# EAGLE design Head Lamp (EAGLE 8.2.2)
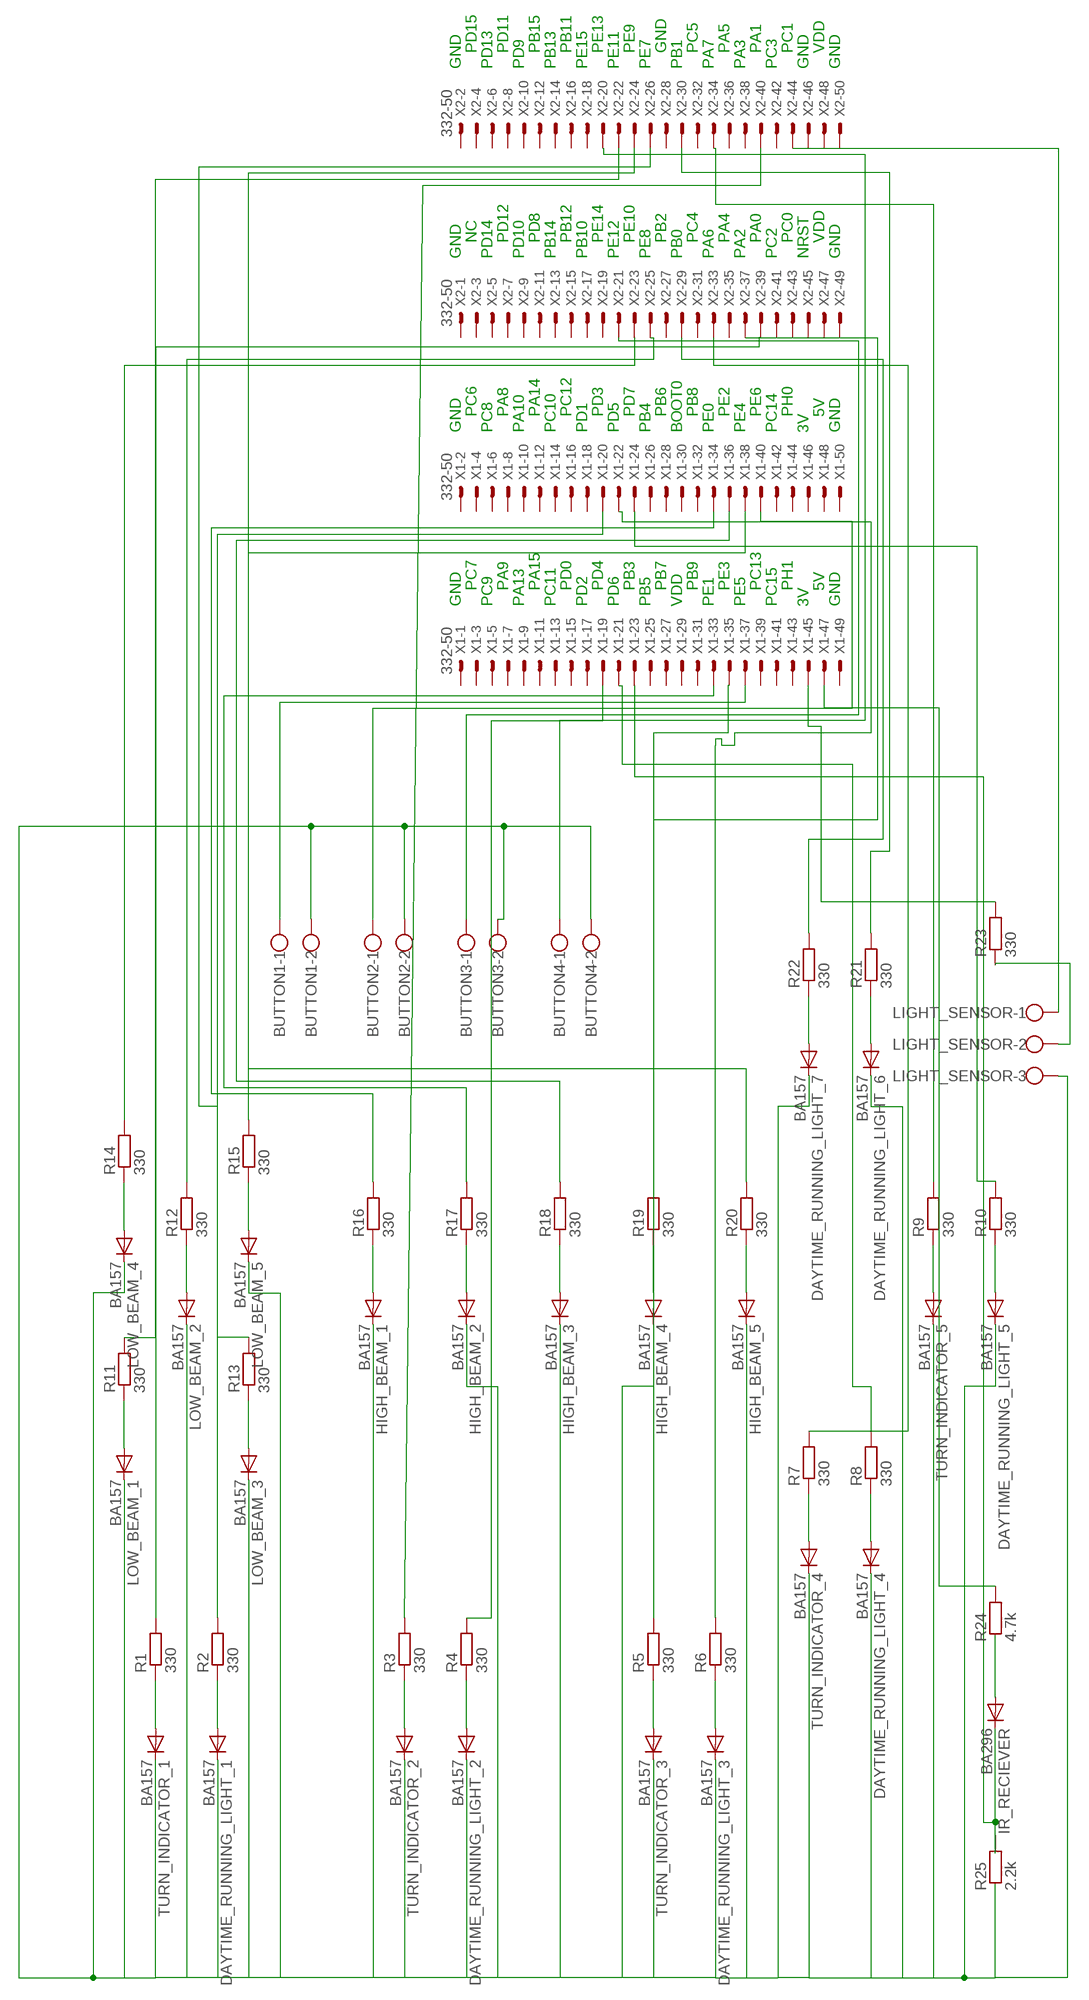
[diagram p0: schematic, sheet 1]

## Parts
BUTTON1  W237-102  [W237-102]
BUTTON2  W237-102  [W237-102]
BUTTON3  W237-102  [W237-102]
BUTTON4  W237-102  [W237-102]
DAYTIME_RUNNING_LIGHT_1  BA157  [P1-10]
DAYTIME_RUNNING_LIGHT_2  BA157  [P1-10]
DAYTIME_RUNNING_LIGHT_3  BA157  [P1-10]
DAYTIME_RUNNING_LIGHT_4  BA157  [P1-10]
DAYTIME_RUNNING_LIGHT_5  BA157  [P1-10]
DAYTIME_RUNNING_LIGHT_6  BA157  [P1-10]
DAYTIME_RUNNING_LIGHT_7  BA157  [P1-10]
HIGH_BEAM_1  BA157  [P1-10]
HIGH_BEAM_2  BA157  [P1-10]
HIGH_BEAM_3  BA157  [P1-10]
HIGH_BEAM_4  BA157  [P1-10]
HIGH_BEAM_5  BA157  [P1-10]
IR_RECIEVER  BA296  [P2-15]
LIGHT_SENSOR  W237-103  [W237-103]
LOW_BEAM_1  BA157  [P1-10]
LOW_BEAM_2  BA157  [P1-10]
LOW_BEAM_3  BA157  [P1-10]
LOW_BEAM_4  BA157  [P1-10]
LOW_BEAM_5  BA157  [P1-10]
R1  330  R0204/7  [0204/7]
R2  330  R0204/7  [0204/7]
R3  330  R0204/7  [0204/7]
R4  330  R0204/7  [0204/7]
R5  330  R0204/7  [0204/7]
R6  330  R0204/7  [0204/7]
R7  330  R0204/7  [0204/7]
R8  330  R0204/7  [0204/7]
R9  330  R0204/7  [0204/7]
R10  330  R0204/7  [0204/7]
R11  330  R0204/7  [0204/7]
R12  330  R0204/7  [0204/7]
R13  330  R0204/7  [0204/7]
R14  330  R0204/7  [0204/7]
R15  330  R0204/7  [0204/7]
R16  330  R0204/7  [0204/7]
R17  330  R0204/7  [0204/7]
R18  330  R0204/7  [0204/7]
R19  330  R0204/7  [0204/7]
R20  330  R0204/7  [0204/7]
R21  330  R0204/7  [0204/7]
R22  330  R0204/7  [0204/7]
R23  330  R0204/7  [0204/7]
R24  4.7k  R0204/7  [0204/7]
R25  2.2k  R0204/7  [0204/7]
TURN_INDICATOR_1  BA157  [P1-10]
TURN_INDICATOR_2  BA157  [P1-10]
TURN_INDICATOR_3  BA157  [P1-10]
TURN_INDICATOR_4  BA157  [P1-10]
TURN_INDICATOR_5  BA157  [P1-10]
X1  332-50  [332-50]
X2  332-50  [332-50]

## Nets
N$1: DAYTIME_RUNNING_LIGHT_1.A R2.1
N$2: R3.1 TURN_INDICATOR_2.A
N$3: DAYTIME_RUNNING_LIGHT_2.A R4.1
N$4: R1.1 TURN_INDICATOR_1.A
N$5: R5.1 TURN_INDICATOR_3.A
N$6: DAYTIME_RUNNING_LIGHT_3.A R6.1
N$7: R7.1 TURN_INDICATOR_4.A
N$8: DAYTIME_RUNNING_LIGHT_4.A R8.1
N$9: R9.1 TURN_INDICATOR_5.A
N$10: DAYTIME_RUNNING_LIGHT_5.A R10.1
N$11: LOW_BEAM_1.A R11.1
N$12: LOW_BEAM_2.A R12.1
N$13: LOW_BEAM_3.A R13.1
N$14: LOW_BEAM_4.A R14.1
N$15: LOW_BEAM_5.A R15.1
N$16: HIGH_BEAM_1.A R16.1
N$17: HIGH_BEAM_2.A R17.1
N$18: HIGH_BEAM_3.A R18.1
N$19: HIGH_BEAM_4.A R19.1
N$20: HIGH_BEAM_5.A R20.1
N$21: DAYTIME_RUNNING_LIGHT_6.A R21.1
N$22: DAYTIME_RUNNING_LIGHT_7.A R22.1
N$23: BUTTON1.1 X1.37
N$24: BUTTON2.1 X1.40
N$26: X1.23
N$28: BUTTON3.1 X2.21
N$29: BUTTON4.1 X2.20
N$30: R16.2 X1.34
N$31: R17.2 X1.33
N$32: R18.2 X1.36
N$33: R19.2 X1.35
N$34: R20.2 X1.38
N$35: R13.2 X2.26
N$36: R12.2 X2.25
N$37: R15.2 X2.24
N$38: R14.2 X2.23
N$39: R11.2 X2.22
N$40: R2.2 X1.20
N$41: R4.2 X1.19
N$42: R6.2 X1.22
N$43: R22.2 X2.29
N$44: R8.2 X1.21
N$45: R10.2 X1.24
N$46: R1.2 X2.39
N$47: R3.2 X2.40
N$48: R5.2 X2.37
N$49: R21.2 X2.30
N$50: R7.2 X2.33
N$51: R9.2 X2.34
N$52: BUTTON1.2 BUTTON2.2 BUTTON3.2 BUTTON4.2 DAYTIME_RUNNING_LIGHT_1.C DAYTIME_RUNNING_LIGHT_2.C DAYTIME_RUNNING_LIGHT_3.C DAYTIME_RUNNING_LIGHT_4.C DAYTIME_RUNNING_LIGHT_5.C DAYTIME_RUNNING_LIGHT_6.C DAYTIME_RUNNING_LIGHT_7.C HIGH_BEAM_1.C HIGH_BEAM_2.C HIGH_BEAM_3.C HIGH_BEAM_4.C HIGH_BEAM_5.C LIGHT_SENSOR.3 LOW_BEAM_1.C LOW_BEAM_2.C LOW_BEAM_3.C LOW_BEAM_4.C LOW_BEAM_5.C TURN_INDICATOR_1.C TURN_INDICATOR_2.C TURN_INDICATOR_3.C TURN_INDICATOR_4.C TURN_INDICATOR_5.C
N$53: R24.2 X1.47
N$54: LIGHT_SENSOR.1 X2.44
N$55: LIGHT_SENSOR.2 R23.1
N$56: R23.2 X1.45
Unconnected: IR_RECIEVER.A IR_RECIEVER.C R24.1 R25.1 R25.2 X1.1 X1.2 X1.3 X1.4 X1.5 X1.6 X1.7 X1.8 X1.9 X1.10 X1.11 X1.12 X1.13 X1.14 X1.15 X1.16 X1.17 X1.18 X1.25 X1.26 X1.27 X1.28 X1.29 X1.30 X1.31 X1.32 X1.39 X1.41 X1.42 X1.43 X1.44 X1.46 X1.48 X1.49 X1.50 X2.1 X2.2 X2.3 X2.4 X2.5 X2.6 X2.7 X2.8 X2.9 X2.10 X2.11 X2.12 X2.13 X2.14 X2.15 X2.16 X2.17 X2.18 X2.19 X2.27 X2.28 X2.31 X2.32 X2.35 X2.36 X2.38 X2.41 X2.42 X2.43 X2.45 X2.46 X2.47 X2.48 X2.49 X2.50

## Notes on the sheet
- PD15 | PD11 | PB15 | PB11 | PE13 | PE9 | GND | PC5 | PA5 | PA1 | PC1 | VDD
- GND | PD13 | PD9 | PB13 | PE15 | PE11 | PE7 | PB1 | PA7 | PA3 | PC3 | GND | GND
- NC | PD12 | PD8 | PB12 | PE14 | PE10 | PB2 | PC4 | PA4 | PA0 | PC0 | VDD
- GND | PD14 | PD10 | PB14 | PB10 | PE12 | PE8 | PB0 | PA6 | PA2 | PC2 | NRST | GND
- PC6 | PA8 | PA14 | PC12 | PD3 | PD7 | PB6 | PB8 | PE2 | PE6 | PH0 | 5V
- GND | PC8 | PA10 | PC10 | PD1 | PD5 | PB4 | BOOT0 | PE0 | PE4 | PC14 | 3V | GND
- PC7 | PA9 | PA15 | PD0 | PD4 | PB3 | PB7 | PB9 | PE3 | PC13 | PH1 | 5V
- GND | PC9 | PA13 | PC11 | PD2 | PD6 | PB5 | VDD | PE1 | PE5 | PC15 | 3V | GND

## Library data of the parts
BUTTON1-BUTTON4 = con-wago-500:W237-102: WAGO SCREW CLAMP; MPN: 237-102; OC_FARNELL: unknown; OC_NEWARK: 70K9898
DAYTIME_RUNNING_LIGHT_1-DAYTIME_RUNNING_LIGHT_7 HIGH_BEAM_1-HIGH_BEAM_5 LOW_BEAM_1-LOW_BEAM_5 TURN_INDICATOR_1-TURN_INDICATOR_5 = diode:BA157: DIODE fast soft-recovery controlled avalanche rectifier
IR_RECIEVER = diode:BA296: DIODE
LIGHT_SENSOR = con-wago-500:W237-103: WAGO SCREW CLAMP; MPN: 237-103; OC_FARNELL: unknown; OC_NEWARK: 18M7116
R1-R25 = eagle-ltspice:R: RESISTOR, European symbol; SPICEMODEL: NONE; SPICEPREFIX: R
X1 X2 = con-garry:332-50: 50 Pin - 2mm Dual Row Source: www.mpe-connector.de / garry_shortform_2012.pdf

## Board
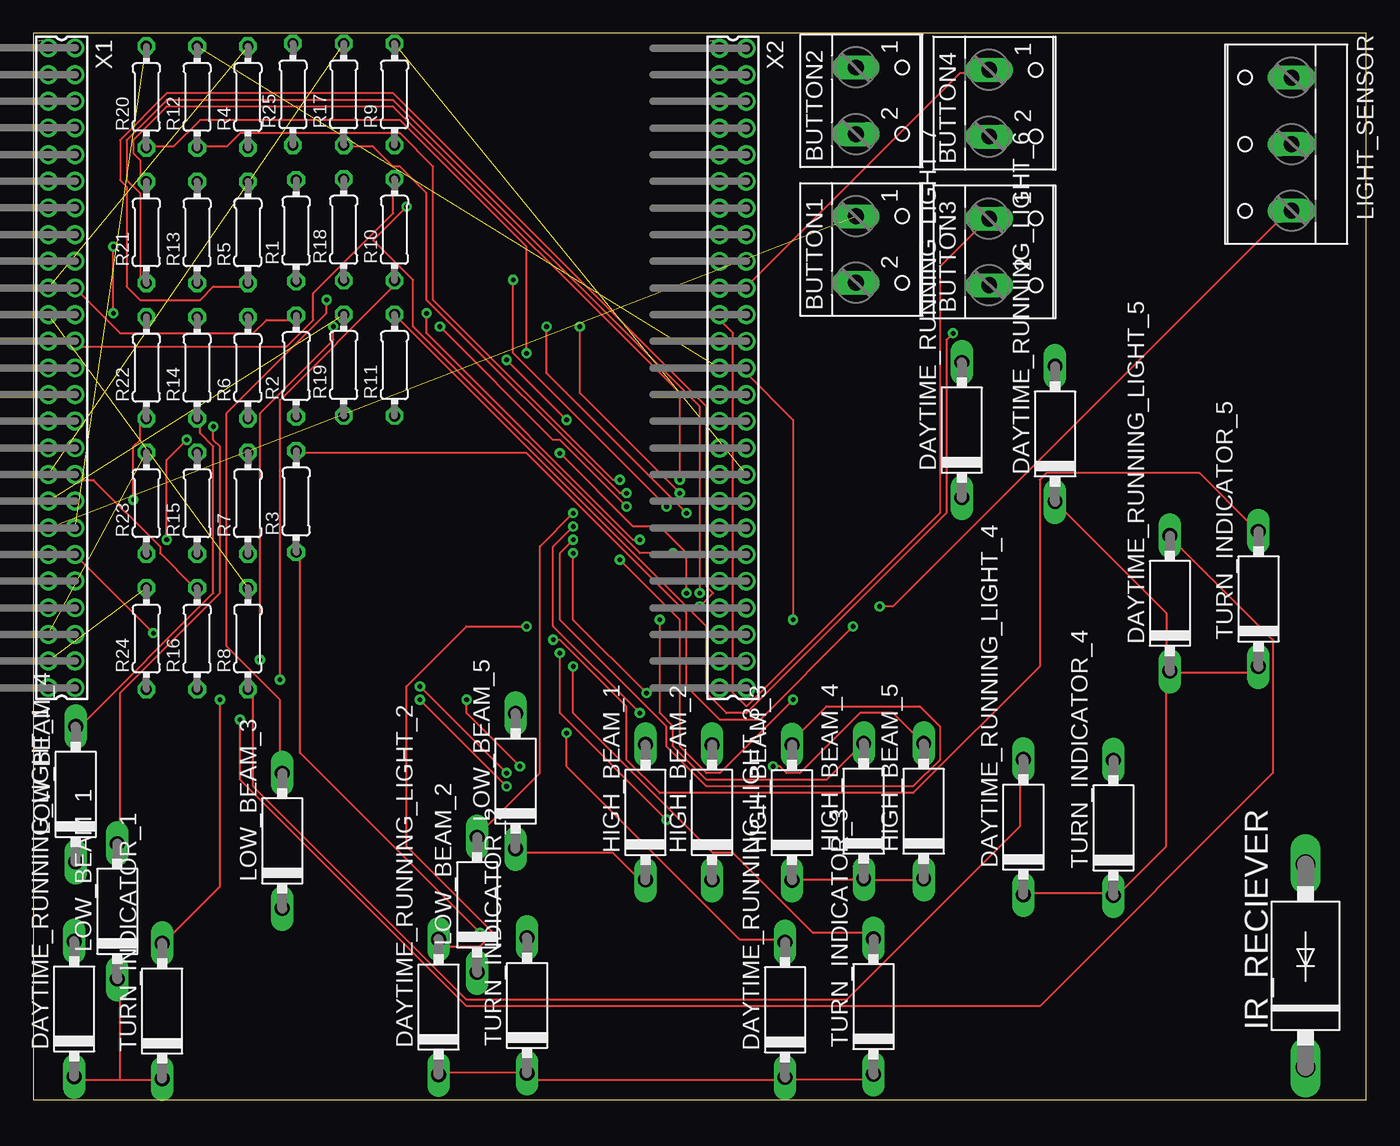
[diagram p1: board, top side]
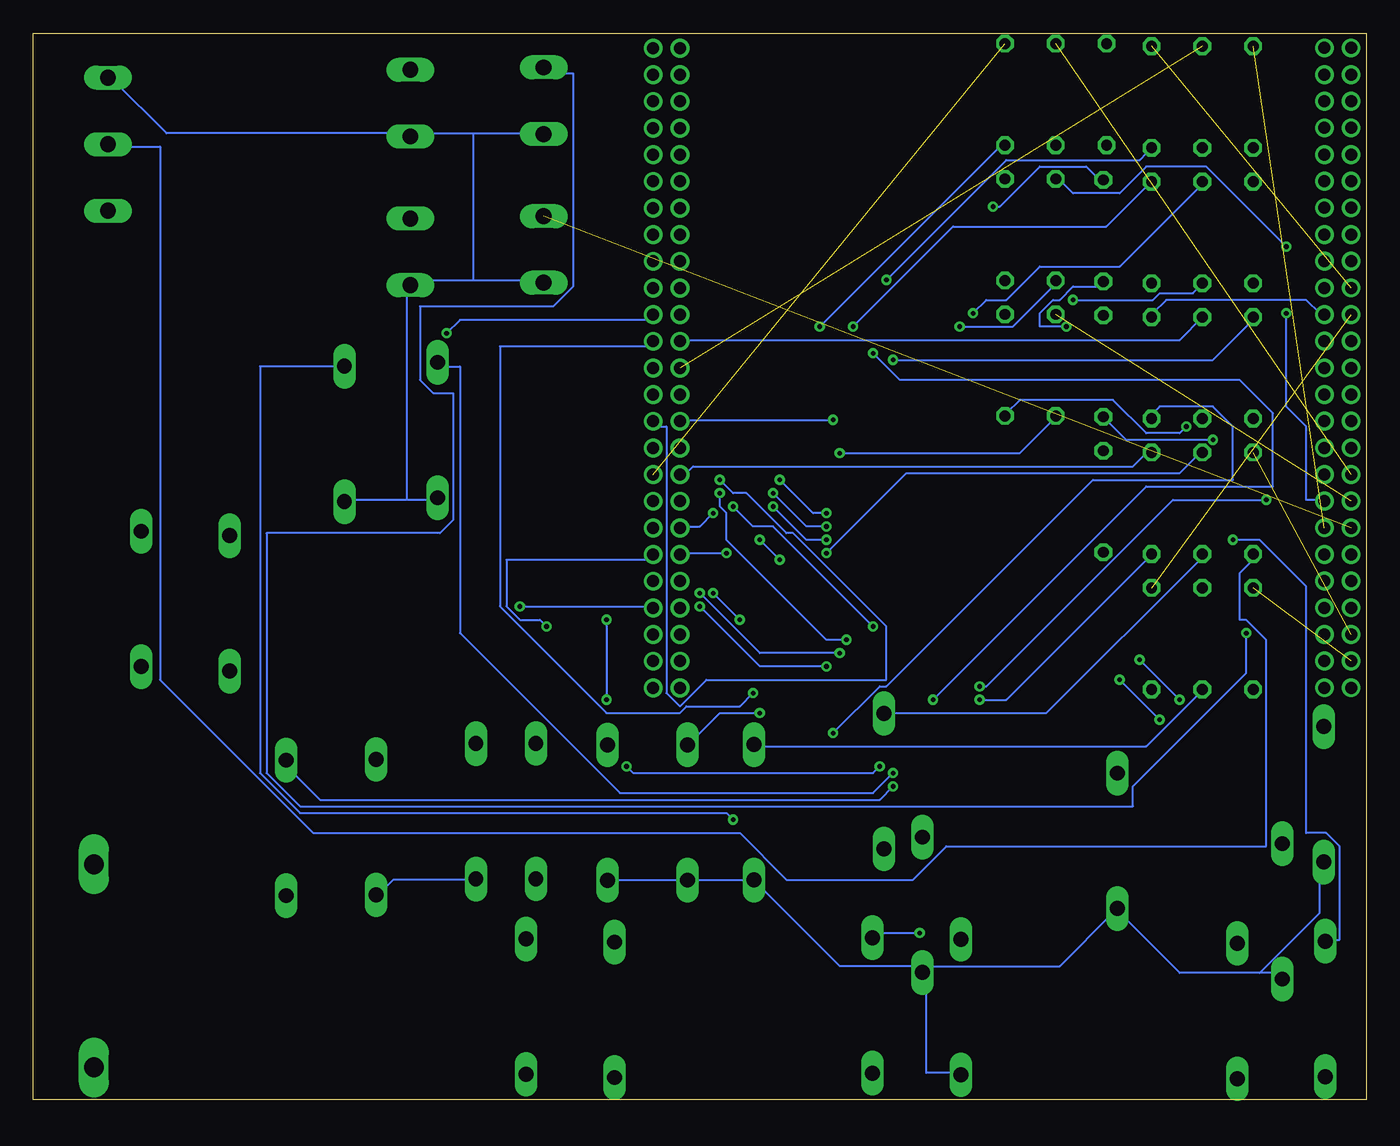
[diagram p2: board, bottom side, seen from below]

Size 100 x 80 mm. Coordinates in mm from the lower left corner, seen from the top.
Outline: 0,0 100,0 100,80 0,80 0,0
Copper layers (1*16): Top 0.035mm / dielectric 1.5mm / Bottom 0.035mm
Design rules "default": minimum track width 6mil, minimum drill 0.35mm, track to track 6mil, track to pad 6mil, pad to pad 6mil, via to via 6mil, smd to smd 6mil, copper to edge 40mil, drill to drill 6mil, minimum pad ring 10mil, minimum via ring 8mil, stop-mask expansion 4mil, vias tented up to drill 0mil, thermal gap 10mil

### Footprints (pad centres in the part's own frame; a part is rotated, then mirrored left to right if it is on the bottom)
W237-102 = drill 1.194 long: 1 -2.5,-1.27; 2 2.5,-1.27
P1-10 = drill 1.118 long: A 5.08,0; C -5.08,0
P2-15 = drill 1.499 long: A 7.62,0; C -7.62,0
W237-103 = drill 1.194 long: 1 -5,-1.29; 2 0,-1.29; 3 5,-1.29
0204/7 = drill 0.813 octagon: 1 -3.81,0; 2 3.81,0
332-50 = drill 0.9 pad 1.27: 1 -24,-1; 2 -24,1; 3 -22,-1; 4 -22,1; 5 -20,-1; 6 -20,1; 7 -18,-1; 8 -18,1; 9 -16,-1; 10 -16,1; 11 -14,-1; 12 -14,1; 13 -12,-1; 14 -12,1; 15 -10,-1; 16 -10,1; 17 -8,-1; 18 -8,1; 19 -6,-1; 20 -6,1; 21 -4,-1; 22 -4,1; 23 -2,-1; 24 -2,1; 25 0,-1; 26 0,1; 27 2,-1; 28 2,1; 29 4,-1; 30 4,1; 31 6,-1; 32 6,1; 33 8,-1; 34 8,1; 35 10,-1; 36 10,1; 37 12,-1; 38 12,1; 39 14,-1; 40 14,1; 41 16,-1; 42 16,1; 43 18,-1; 44 18,1; 45 20,-1; 46 20,1; 47 22,-1; 48 22,1; 49 24,-1; 50 24,1

### Placement (x,y rotation side)
BUTTON1  62.98,63.78 270 top
BUTTON2  62.98,74.94 270 top
BUTTON3  72.98,63.6 270 top
BUTTON4  72.98,74.76 270 top
DAYTIME_RUNNING_LIGHT_1  3.06,6.8 90 top
DAYTIME_RUNNING_LIGHT_2  30.4,6.94 90 top
DAYTIME_RUNNING_LIGHT_3  56.4,6.73 90 top
DAYTIME_RUNNING_LIGHT_4  74.28,20.44 90 top
DAYTIME_RUNNING_LIGHT_5  85.28,37.23 90 top
DAYTIME_RUNNING_LIGHT_6  76.66,49.94 90 top
DAYTIME_RUNNING_LIGHT_7  69.66,50.23 90 top
HIGH_BEAM_1  45.92,21.55 90 top
HIGH_BEAM_2  50.92,21.54 90 top
HIGH_BEAM_3  56.92,21.53 90 top
HIGH_BEAM_4  62.3,21.64 90 top
HIGH_BEAM_5  66.8,21.63 90 top
IR_RECIEVER  95.45,10.03 90 top
LIGHT_SENSOR  93.11,71.68 90 top
LOW_BEAM_1  6.3,14.12 90 top
LOW_BEAM_2  33.3,14.61 90 top
LOW_BEAM_3  18.68,19.41 90 top
LOW_BEAM_4  3.18,22.9 90 top
LOW_BEAM_5  36.18,23.89 90 top
R1  19.72,65.19 90 top
R2  19.72,55.03 90 top
R3  19.72,44.87 90 top
R4  16.1,75.22 90 top
R5  16.1,65.06 90 top
R6  16.1,54.9 90 top
R7  16.1,44.74 90 top
R8  16.1,34.58 90 top
R9  27.1,75.42 90 top
R10  27.1,65.26 90 top
R11  27.1,55.1 90 top
R12  12.29,75.22 90 top
R13  12.29,65.06 90 top
R14  12.29,54.9 90 top
R15  12.29,44.74 90 top
R16  12.29,34.58 90 top
R17  23.29,75.42 90 top
R18  23.29,65.26 90 top
R19  23.29,55.1 90 top
R20  8.48,75.22 90 top
R21  8.48,65.06 90 top
R22  8.48,54.9 90 top
R23  8.48,44.74 90 top
R24  8.48,34.58 90 top
R25  19.48,75.42 90 top
TURN_INDICATOR_1  9.66,6.64 90 top
TURN_INDICATOR_2  37.04,7.06 90 top
TURN_INDICATOR_3  63.04,6.97 90 top
TURN_INDICATOR_4  81.04,20.38 90 top
TURN_INDICATOR_5  91.92,37.56 90 top
X1  2.13,54.9 270 top
X2  52.49,54.89 270 top

### Tracks (layer width: path | path; a pad name or v marks a point on that pad's centre or on a via)
N$1  (via drill 0.35)
  Top 0.152: v11.5,49.5 10,48 v10,42
  Bottom 0.152: R2.1 18,49.5 v11.5,49.5 | v10,42 8,42 4.5,38.5 4.5,20 3,20 2,19 2,12 3,12 DAYTIME_RUNNING_LIGHT_1.A
N$2  (via drill 0.35)
  Top 0.152: v33.5,12.5 20,26 20,41 R3.1
  Bottom 0.152: v33.5,12.5 37,12.5 TURN_INDICATOR_2.A
N$3  (via drill 0.35)
  Top 0.152: v36,61.5 36,56 v47.5,44.5 | v37,35.5 32.5,35.5 28,31 28,19 34.5,12.5 33.5,11.5 31,11.5 30.5,12 DAYTIME_RUNNING_LIGHT_2.A
  Bottom 0.152: v36,61.5 27,70.5 17,70.5 16.5,71 R4.1 | v47.5,44.5 46,43 44.5,43 v37,35.5
N$4  (via drill 0.35)
  Top 0.152: v22.5,58 22.5,57 17,51.5 v17,33 | v14,30 14,16 10,12 TURN_INDICATOR_1.A
  Bottom 0.152: v22.5,58 24.5,58 24.5,59 23.5,60 23,60 22,61 20,61 R1.1 | v14,30 v17,33
N$5  (via drill 0.35)
  Top 0.152: v50,37 51,38 50.5,38.5 50.5,52 27,75.5 10,75.5 6.5,72 6.5,69 7,68.5 7,61 8,60 12.5,60 13.5,61 16,61 R5.1 | v40.5,32.5 40.5,29 51,18.5 52.5,18.5 58.5,12.5 63,12.5 TURN_INDICATOR_3.A
  Bottom 0.152: v50,37 45.5,32.5 v40.5,32.5
N$6  (via drill 0.35)
  Top 0.152: v40,27.5 40,25 53,12 56,12 DAYTIME_RUNNING_LIGHT_3.A
  Bottom 0.152: v40,27.5 36.5,31 36,31 20.5,46.5 10,46.5 10,50.5 11.5,52 15.5,52 16,51.5 R6.1
N$7  (via drill 0.35)
  Top 0.152: v35.5,23.5 v29,30
  Bottom 0.152: v29,30 27,30 16.5,40.5 R7.1 | v35.5,23.5 36.5,22.5 78.5,22.5 81,25 TURN_INDICATOR_4.A
N$8
  Top 0.152: R8.1 16.5,30.5 16.5,23.5 32.5,7.5 61,7.5 74,20.5 74,25.5 DAYTIME_RUNNING_LIGHT_4.A
N$9  (via drill 0.35)
  Top 0.152: v41,58 41,53 v48.5,45.5 | v39,34.5 39.5,34.5 44.5,29.5 44.5,25.5 47,23 66,23 75.5,32.5 75.5,46.5 76,47 87.5,47 91.5,43 TURN_INDICATOR_5.A
  Bottom 0.152: v41,58 27.5,71.5 R9.1 | v48.5,45.5 48.5,44.5 48,44 48,42 40.5,34.5 v39,34.5
N$10  (via drill 0.35)
  Top 0.152: v18.5,31.5 18.5,52.5 27,61 R10.1 | v15.5,28.5 15.5,24 32.5,7 75.5,7 93,24.5 93,34.5 85.5,42 DAYTIME_RUNNING_LIGHT_5.A
  Bottom 0.152: v15.5,28.5 v18.5,31.5
N$11  (via drill 0.35)
  Top 0.152: v13.5,50.5 13.5,49.5 14,49 14,38 6.5,30.5 6.5,19.5 LOW_BEAM_1.A
  Bottom 0.152: v13.5,50.5 14,50 16.5,50 19,52.5 26,52.5 27,51.5 R11.1
N$12  (via drill 0.35)
  Top 0.152: v44,46.5 43.5,46.5 30,60 30,70 27.5,72.5 15.5,72.5 14.5,71.5 12.5,71.5 R12.1 | v40.5,44 38,41.5 38,24.5 33.5,20 LOW_BEAM_2.A
  Bottom 0.152: v44,46.5 41.5,44 v40.5,44
N$13  (via drill 0.35)
  Top 0.152: v22,60 22,59 14.5,51.5 14.5,34 18.5,30 18.5,24.5 LOW_BEAM_3.A
  Bottom 0.152: v22,60 16,60 15.5,60.5 13,60.5 12.5,61 R13.1
N$14
  Top 0.152: R14.1 12.5,51 12.5,50 13.5,49 13.5,38 3.5,28 LOW_BEAM_4.A
N$15
  Bottom 0.152: R15.1 12.5,40.5 24,29 36,29 LOW_BEAM_5.A
N$16
  Bottom 0.152: R16.1 12.5,30.5 16.5,26.5 45.5,26.5 HIGH_BEAM_1.A
N$17  (via drill 0.35)
  Top 0.152: v44.5,45.5 44,45.5 29.5,60 29.5,68 27.5,70 27,70 25.5,71.5 23.5,71.5 R17.1 | v40.5,43 39,41.5 39,35.5 v45.5,29
  Bottom 0.152: v44.5,45.5 42,43 v40.5,43 | v45.5,29 48.5,29 50.5,27 HIGH_BEAM_2.A
N$18  (via drill 0.35)
  Top 0.152: v30.5,58 39,49.5 39.5,49.5 v44.5,44.5 | v40.5,42 39.5,41 39.5,36 47.5,28 47.5,26.5 50.5,23.5 66,23.5 68,25.5 68,28 66.5,29.5 59.5,29.5 57,27 HIGH_BEAM_3.A
  Bottom 0.152: v30.5,58 26.5,58 23.5,61 R18.1 | v44.5,44.5 42,42 v40.5,42
N$19  (via drill 0.35)
  Top 0.152: v39.5,48.5 45,43 47,43 49,41 v49,38 | v47,36 47,29 48,28 48,26.5 50.5,24 59.5,24 62,26.5 HIGH_BEAM_4.A
  Bottom 0.152: v39.5,48.5 26,48.5 23.5,51 R19.1 | v47,36 v49,38
N$20  (via drill 0.35)
  Top 0.152: v37,56 37,64 27.5,73.5 12.5,73.5 10.5,71.5 8.5,71.5 R20.1 | v32.5,30 32.5,29 v36.5,25 | v55.5,25 56,25 56.5,24.5 57.5,24.5 62,29 64.5,29 66.5,27 HIGH_BEAM_5.A
  Bottom 0.152: v37,56 35,54 9.5,54 7,51.5 7,46 16.5,46 v32.5,30 | v36.5,25 37,24.5 55,24.5 v55.5,25
N$21  (via drill 0.35)
  Top 0.152: v50,38 50,52 27,75 10,75 7,72 7,69 8,68 8,61.5 R21.1 | v39.5,33.5 39.5,29 v47.5,21
  Bottom 0.152: v50,38 45.5,33.5 v39.5,33.5 | v47.5,21 48,21.5 80,21.5 83,24.5 83,55 77,55 DAYTIME_RUNNING_LIGHT_6.A
N$22  (via drill 0.35)
  Top 0.152: v7.5,45 7.5,49 8,49.5 8,51 R22.1 | v35.5,24.5 v29,31
  Bottom 0.152: v7.5,45 14.5,45 28.5,31 v29,31 | v35.5,24.5 37,23 56,23 68,35 68,55 69.5,55 DAYTIME_RUNNING_LIGHT_7.A
N$23  (1 unrouted)
N$24  (via drill 0.35)
  Top 0.152: v9,35 3.5,40.5 X1.40
  Bottom 0.152: v9,35 9,32 17.5,23.5 17.5,22 80,22 82.5,24.5 82.5,42.5 69.5,42.5 68.5,43.5 68.5,53 70,53 71,54 71,59.5 61,59.5 59.5,61 59.5,77 61.5,77 BUTTON2.1
N$28
  Top 0.152: X2.21 51.5,58.5 52.5,57.5 52.5,30.5 53.5,29.5 68,44 68,62.5 71.5,66 BUTTON3.1
N$29
  Top 0.152: X2.20 53.5,61 69.5,77 71.5,77 BUTTON4.1
N$30
  Top 0.152: R16.2 12,38.5 9.5,41 9.5,41.5 4.5,46.5 3.5,46.5 X1.34
N$31  (1 unrouted)
N$32  (via drill 0.35)
  Top 0.152: v6,59 v6,64
  Bottom 0.152: v6,64 12,70 16.5,70 18.5,68 22,68 23,69 R18.2 | v6,59 6,52 4.5,50.5 4.5,45 3.5,45 X1.36
N$33  (1 unrouted)
N$34  (1 unrouted)
N$35  (via drill 0.35)
  Top 0.152: v29.5,59 29.5,57.5 45,42 v45.5,42 | v44,40.5 48.5,36 48.5,26.5 50.5,24.5 51.5,24.5 v57,30 | v57,36 57,51 53.5,54.5 X2.26
  Bottom 0.152: v29.5,59 28.5,60 27,60 24.5,62.5 18.5,62.5 12.5,68.5 R13.2 | v44,40.5 v45.5,42 | v57,36 v57,30
N$36  (1 unrouted)
N$37  (via drill 0.35)
  Top 0.152: v40.5,41 40.5,36 v46,30.5
  Bottom 0.152: v40.5,41 34.5,47 14,47 12.5,48.5 R15.2 | v46,30.5 47,29.5 51,29.5 51.5,29 57,29 65,37 65,56.5 53.5,56.5 X2.24
N$38
  Bottom 0.152: R14.2 14,57 51,57 X2.23
N$39  (via drill 0.35)
  Top 0.152: v69,57.5 68.5,57 68.5,44 53.5,29 52,29 50.5,30.5 50.5,35.5 27.5,58.5 R11.2
  Bottom 0.152: v69,57.5 68,58.5 53.5,58.5 X2.22
N$40
  Top 0.152: R2.2 19.5,58.5 17.5,58.5 16.5,57.5 6.5,57.5 3.5,60.5 X1.20
N$41  (1 unrouted)
N$42
  Bottom 0.152: R6.2 16,59 15,60 4.5,60 3.5,59 X1.22
N$43  (via drill 0.35)
  Top 0.152: v40,51 v35.5,55.5
  Bottom 0.152: v35.5,55.5 11.5,55.5 8.5,58.5 R22.2 | v40,51 51,51 X2.29
N$44  (1 unrouted)
N$45
  Top 0.152: R10.2 27,69 27,66.5 21,60.5 21,58.5 19,56.5 3.5,56.5 X1.24
N$46  (via drill 0.35)
  Top 0.152: v28,67 25.5,64.5 28.5,61.5 28.5,58 45.5,41 v48,41
  Bottom 0.152: v28,67 27.5,67 24.5,70 21,70 20,69 R1.2 | v48,41 51,41 X2.39
N$47  (via drill 0.35)
  Top 0.152: v61.5,35.5 54.5,28.5 51.5,28.5 49,31 49,36.5 37,48.5 20,48.5 R3.2
  Bottom 0.152: v61.5,35.5 62,36 63.5,36 64.5,37 64.5,40.5 53.5,40.5 X2.40
N$48  (via drill 0.35)
  Top 0.152: v38.5,58 38.5,54.5 v49,44
  Bottom 0.152: v38.5,58 31,65.5 19.5,65.5 16.5,68.5 R5.2 | v49,44 50,43 51,43 X2.37
N$49  (via drill 0.35)
  Top 0.152: v48.5,46.5 48.5,53 27,74.5 10,74.5 7.5,72 7.5,71 8,70.5 8,69 R21.2
  Bottom 0.152: v48.5,46.5 47.5,45.5 46.5,45.5 43.5,42.5 43,42.5 36,35.5 36,31.5 49.5,31.5 51.5,29.5 52.5,30.5 52.5,50.5 53,50.5 X2.30
N$50
  Bottom 0.152: R7.2 16.5,48.5 17.5,47.5 50.5,47.5 51,47 X2.33
N$51  (1 unrouted)
N$52
  Top 0.152: DAYTIME_RUNNING_LIGHT_5.C 85.5,32 91.5,32 TURN_INDICATOR_5.C | DAYTIME_RUNNING_LIGHT_5.C 85,32.5 85,36.5 77,44.5 DAYTIME_RUNNING_LIGHT_6.C | LOW_BEAM_5.C 36.5,18.5 43.5,18.5 45.5,16.5 HIGH_BEAM_1.C | DAYTIME_RUNNING_LIGHT_4.C 74.5,15.5 81,15.5 TURN_INDICATOR_4.C 81.5,15.5 85,19 85,32 DAYTIME_RUNNING_LIGHT_5.C | HIGH_BEAM_3.C 57,16.5 62,16.5 HIGH_BEAM_4.C 62.5,16.5 66.5,16.5 HIGH_BEAM_5.C | 6.5,1.5 3.5,1.5 DAYTIME_RUNNING_LIGHT_1.C | 6.5,1.5 9.5,1.5 TURN_INDICATOR_1.C | 6.5,1.5 6.5,9 LOW_BEAM_1.C | TURN_INDICATOR_3.C 63,1.5 56.5,1.5 DAYTIME_RUNNING_LIGHT_3.C 56,1.5 37.5,1.5 TURN_INDICATOR_2.C 37,2 30.5,2 DAYTIME_RUNNING_LIGHT_2.C
  Bottom 0.152: 72,45 70,45 DAYTIME_RUNNING_LIGHT_7.C | 72,45 76.5,45 DAYTIME_RUNNING_LIGHT_6.C | 67,61.5 71.5,61.5 BUTTON3.2 72,61 72,45 | 67,61.5 62,61.5 BUTTON1.2 | 67,72.5 71.5,72.5 BUTTON4.2 72,72.5 90,72.5 94,76.5 LIGHT_SENSOR.3 | 67,72.5 62,72.5 BUTTON2.2 | 67,72.5 67,61.5 | DAYTIME_RUNNING_LIGHT_4.C 74,15.5 73,16.5 67,16.5 HIGH_BEAM_5.C | HIGH_BEAM_3.C 56.5,16.5 51,16.5 HIGH_BEAM_2.C 50.5,16.5 46,16.5 HIGH_BEAM_1.C 45.5,16 39.5,10 33.5,10 LOW_BEAM_2.C | 8,9.5 6.5,9.5 LOW_BEAM_1.C | 8,9.5 14,9.5 18.5,14 LOW_BEAM_3.C 19,14 23,10 33,10 LOW_BEAM_2.C | 8,9.5 3.5,14 3.5,17.5 LOW_BEAM_4.C | LOW_BEAM_2.C 33,9.5 33,2 30.5,2 DAYTIME_RUNNING_LIGHT_2.C
N$53  (1 unrouted)
N$54  (via drill 0.35)
  Top 0.152: v63.5,37 64.5,37 94,66.5 LIGHT_SENSOR.1
  Bottom 0.152: v63.5,37 53.5,37 X2.44
N$55
  Bottom 0.152: R23.1 8.5,40.5 9.5,39.5 9.5,36 9,36 7.5,34.5 7.5,19 31.5,19 34,16.5 43.5,16.5 47,20 79,20 90.5,31.5 90.5,71.5 94,71.5 LIGHT_SENSOR.2
N$56  (1 unrouted)